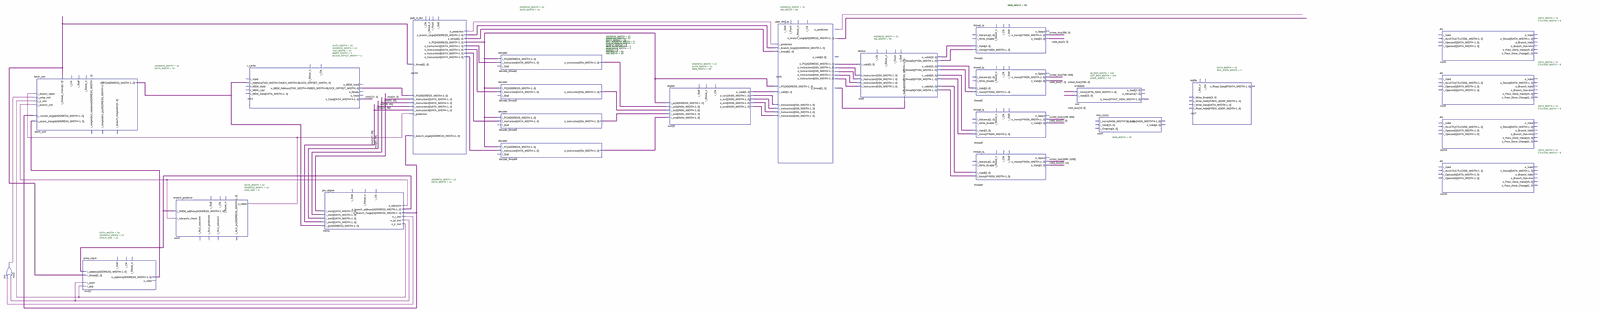
[diagram p0: schematic sheet, whole]
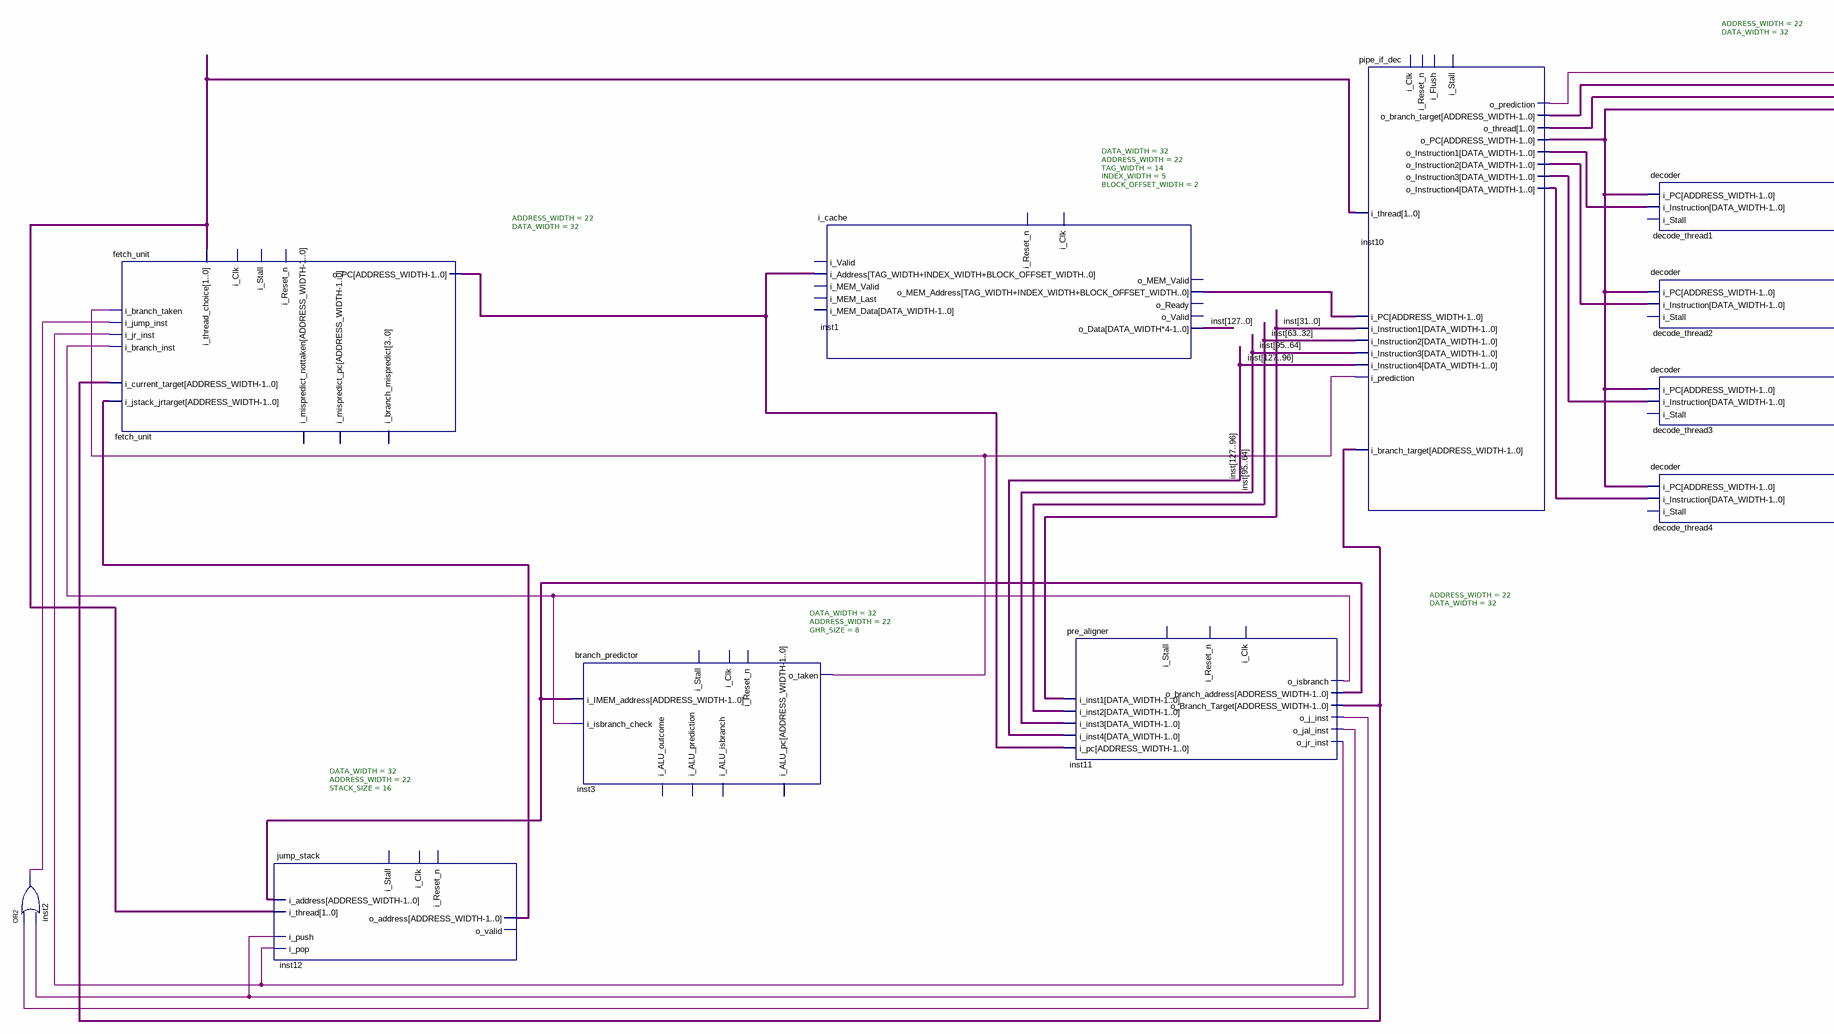
[diagram p1: schematic sheet, left part]
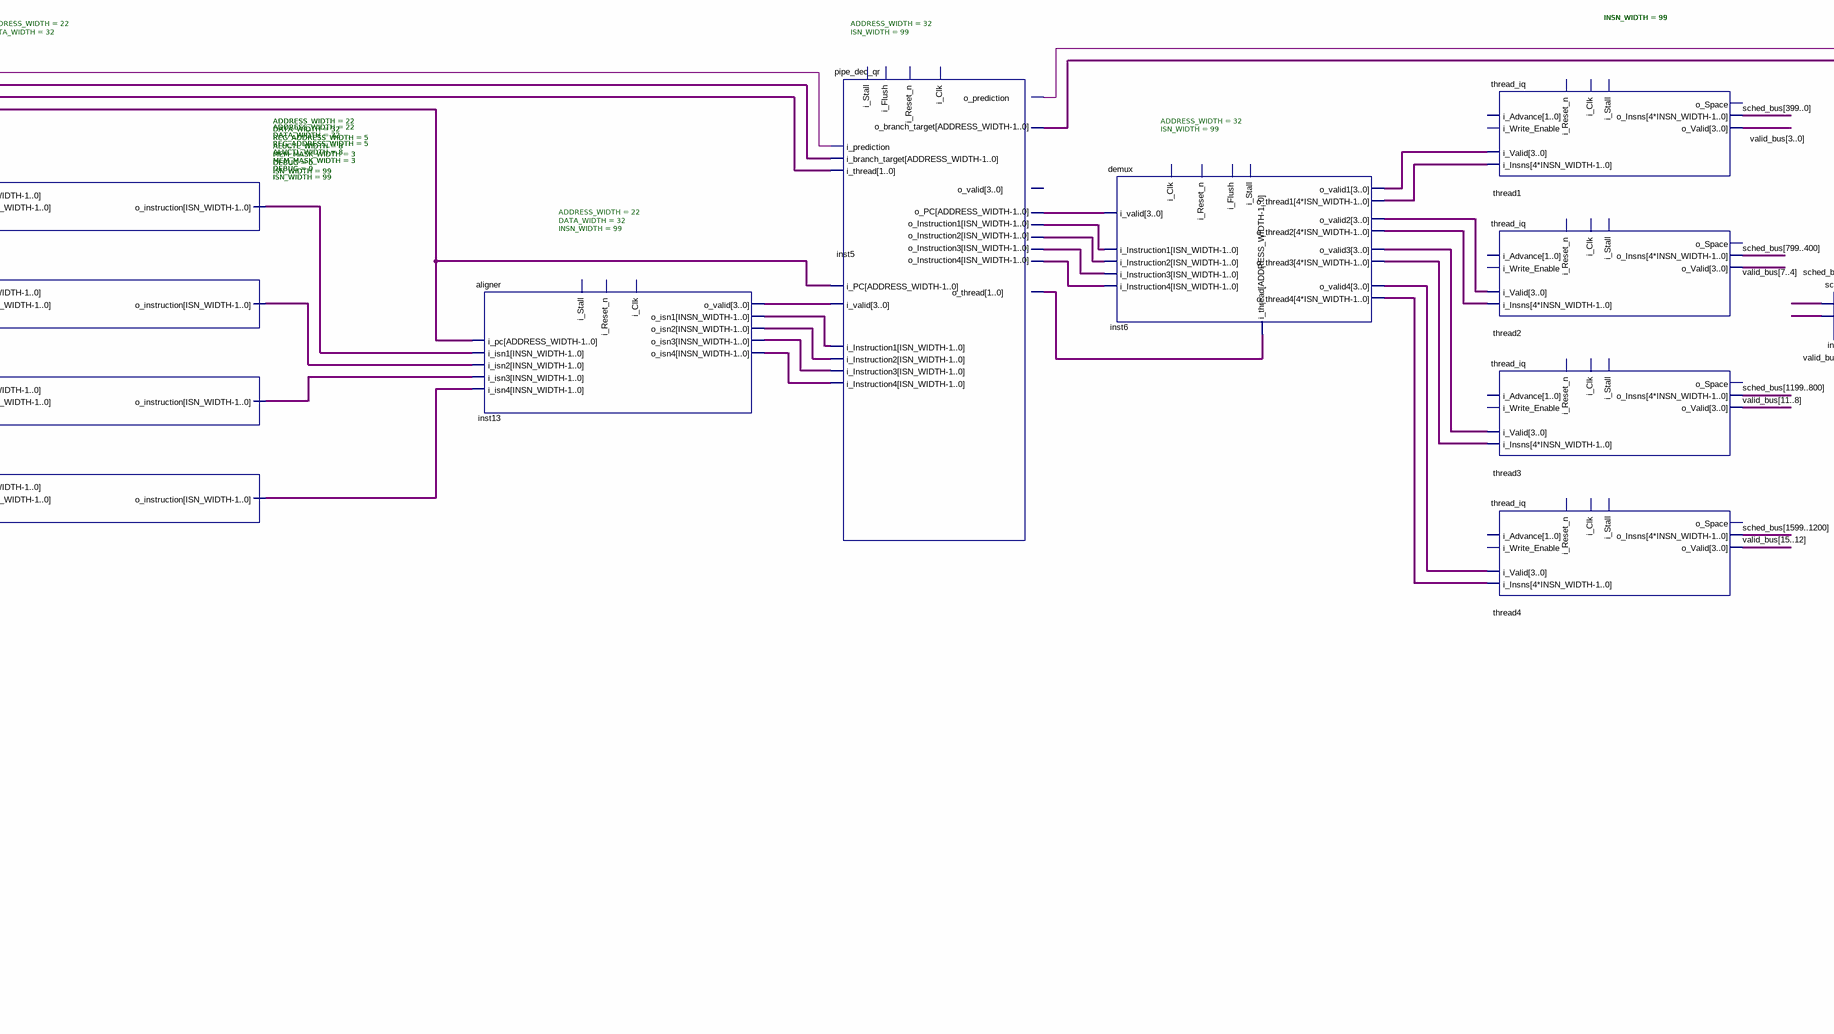
[diagram p2: schematic sheet, centre part]
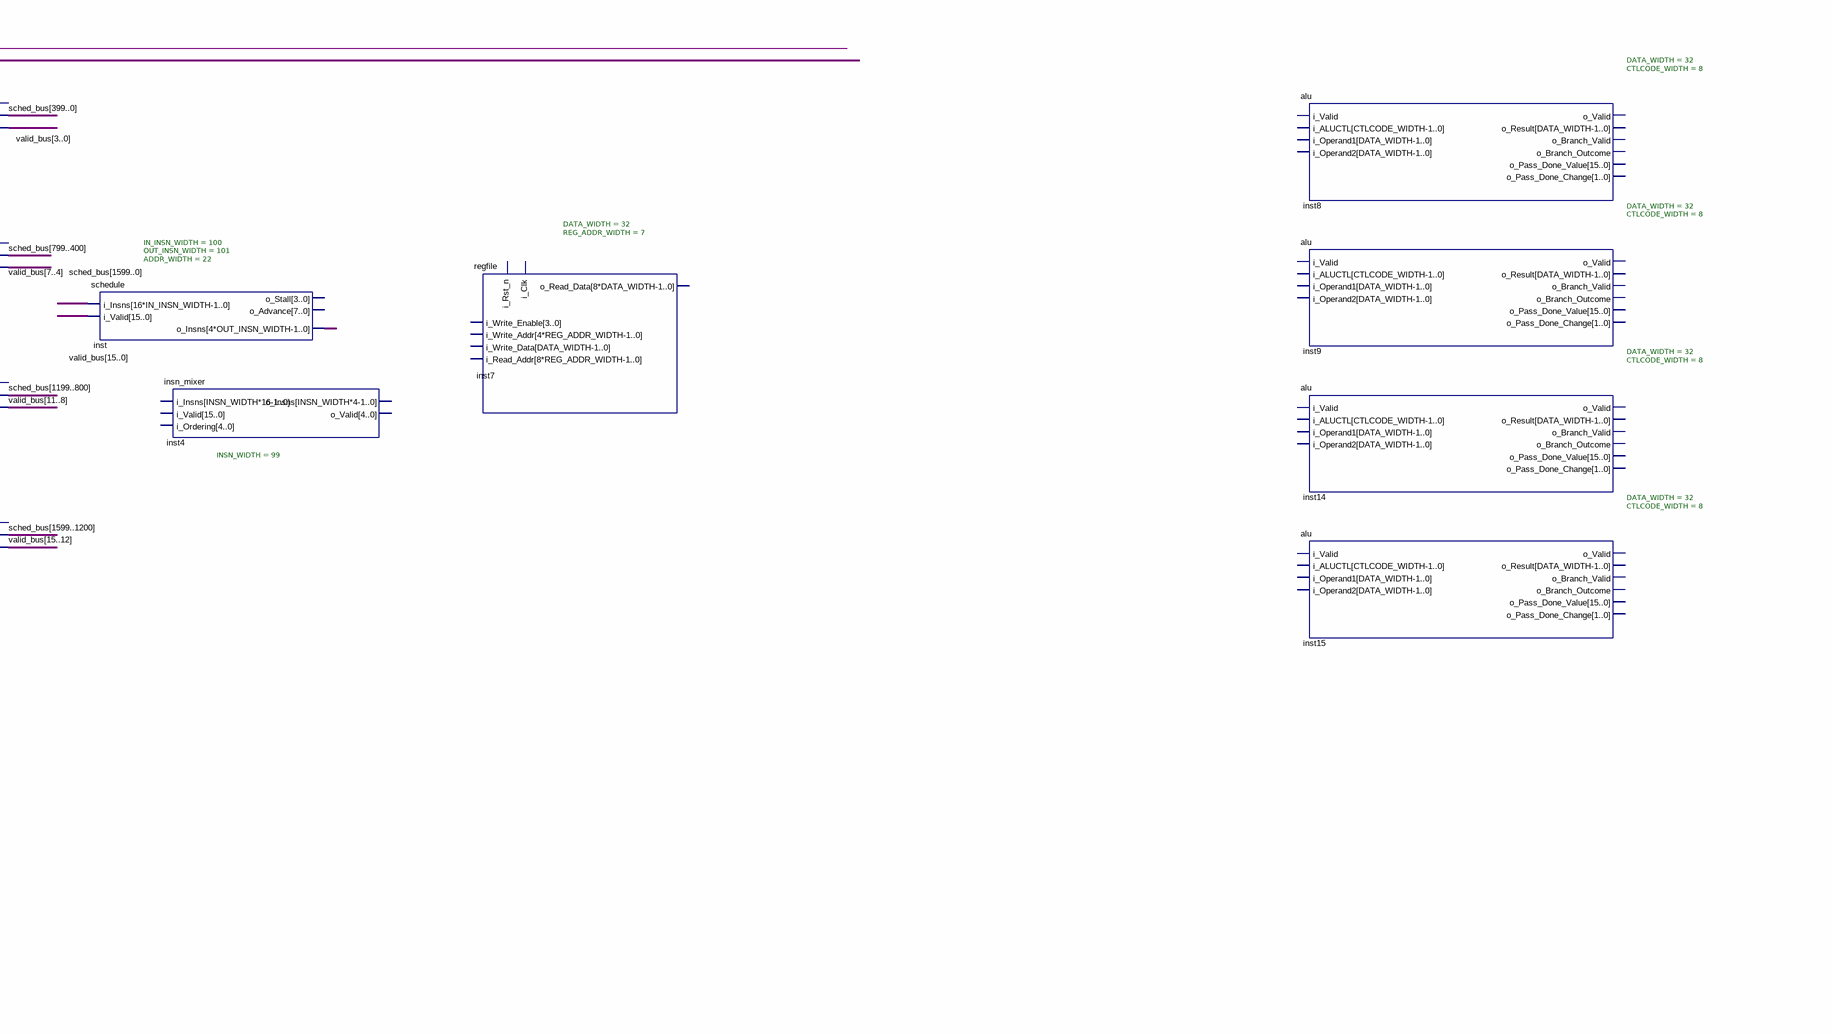
[diagram p3: schematic sheet, right part]
// Quartus schematic SMT-Proc.bdf as structural Verilog: 25 symbols, 0 pins
module \SMT-Proc  (
);

  wire inst2_out, inst3_o_taken, inst5_o_prediction, inst10_o_prediction, inst11_o_isbranch, inst11_o_j_inst,
       inst11_o_jal_inst, inst11_o_jr_inst;
  wire [1:0] inst10_o_thread, undriven;
  wire [3:0] inst6_o_valid1, inst6_o_valid2, inst6_o_valid3, inst6_o_valid4, inst13_o_valid;
  wire [15:0] valid_bus;
  wire [21:0] fetch_unit_o_pc, inst1_o_mem_address, inst11_o_branch_address, inst11_o_branch_target,
       inst12_o_address;
  wire [31:0] inst5_o_branch_target, inst5_o_pc, inst5_o_thread, inst10_o_branch_target,
       inst10_o_instruction1, inst10_o_instruction2, inst10_o_instruction3, inst10_o_instruction4,
       inst10_o_pc;
  wire [98:0] decode_thread1_o_instruction, decode_thread2_o_instruction, decode_thread3_o_instruction,
       decode_thread4_o_instruction, inst5_o_instruction1, inst5_o_instruction2, inst5_o_instruction3,
       inst5_o_instruction4, inst13_o_isn1, inst13_o_isn2, inst13_o_isn3, inst13_o_isn4;
  wire [127:0] inst;
  wire [395:0] inst6_o_thread1, inst6_o_thread2, inst6_o_thread3, inst6_o_thread4;
  wire [403:0] inst_o_insns;
  wire [1599:0] sched_bus;

  or inst2 (inst2_out, inst11_o_j_inst, inst11_o_jal_inst);
  fetch_unit #(.ADDRESS_WIDTH(22), .DATA_WIDTH(32)) fetch_unit (
    .i_branch_taken(inst3_o_taken), .i_jump_inst(inst2_out), .i_jr_inst(inst11_o_jr_inst),
    .i_branch_inst(inst11_o_isbranch), .i_thread_choice(undriven), .i_current_target(inst11_o_branch_target),
    .i_jstack_jrtarget(inst12_o_address), .o_PC(fetch_unit_o_pc));  // open: i_Clk, i_Reset_n, i_Stall, i_branch_mispredict, i_mispredict_nottaken, i_mispredict_pc
  jump_stack #(.DATA_WIDTH(32), .ADDRESS_WIDTH(22), .STACK_SIZE(16)) inst12 (
    .i_address(inst11_o_branch_address), .i_thread(undriven), .i_pop(inst11_o_jr_inst),
    .i_push(inst11_o_jal_inst), .o_address(inst12_o_address));  // open: i_Clk, i_Stall, i_Reset_n, o_valid
  branch_predictor #(.DATA_WIDTH(32), .ADDRESS_WIDTH(22), .GHR_SIZE(8)) inst3 (
    .i_IMEM_address(inst11_o_branch_address), .i_isbranch_check(inst11_o_isbranch), .o_taken(inst3_o_taken));  // open: i_Clk, i_ALU_outcome, i_ALU_pc, i_ALU_isbranch, i_ALU_prediction, i_Reset_n, i_Stall
  i_cache #(.DATA_WIDTH(32), .ADDRESS_WIDTH(22), .TAG_WIDTH(14), .INDEX_WIDTH(5), .BLOCK_OFFSET_WIDTH(2)) inst1 (
    .i_Address(fetch_unit_o_pc), .o_MEM_Address(inst1_o_mem_address), .o_Data(inst));  // open: i_Clk, i_Reset_n, i_Valid, i_MEM_Valid, i_MEM_Last, i_MEM_Data, o_MEM_Valid, o_Ready, o_Valid
  pre_aligner #(.ADDRESS_WIDTH(22), .DATA_WIDTH(32)) inst11 (
    .i_pc(fetch_unit_o_pc), .i_inst1(inst[31:0]), .i_inst2(inst[63:32]), .i_inst3(inst[95:64]),
    .i_inst4(inst[127:96]), .o_isbranch(inst11_o_isbranch), .o_branch_address(inst11_o_branch_address),
    .o_Branch_Target(inst11_o_branch_target), .o_j_inst(inst11_o_j_inst), .o_jal_inst(inst11_o_jal_inst),
    .o_jr_inst(inst11_o_jr_inst));  // open: i_Clk, i_Reset_n, i_Stall
  pipe_if_dec #(.ADDRESS_WIDTH(22), .DATA_WIDTH(32)) inst10 (
    .i_PC(inst1_o_mem_address), .i_Instruction1(inst[31:0]), .i_Instruction2(inst[63:32]),
    .i_Instruction3(inst[95:64]), .i_Instruction4(inst[127:96]), .i_prediction(inst3_o_taken),
    .i_branch_target(inst11_o_branch_target), .i_thread(undriven), .o_PC(inst10_o_pc),
    .o_Instruction1(inst10_o_instruction1), .o_Instruction2(inst10_o_instruction2),
    .o_Instruction3(inst10_o_instruction3), .o_Instruction4(inst10_o_instruction4),
    .o_prediction(inst10_o_prediction), .o_branch_target(inst10_o_branch_target), .o_thread(inst10_o_thread));  // open: i_Clk, i_Reset_n, i_Flush, i_Stall
  decoder #(.ADDRESS_WIDTH(22), .DATA_WIDTH(32), .REG_ADDRESS_WIDTH(5), .ALUCTL_WIDTH(8), .MEM_MASK_WIDTH(3), .DEBUG(0), .ISN_WIDTH(99)) decode_thread1 (
    .i_PC(inst10_o_pc), .i_Instruction(inst10_o_instruction1), .o_instruction(decode_thread1_o_instruction));  // open: i_Stall
  decoder #(.ADDRESS_WIDTH(22), .DATA_WIDTH(32), .REG_ADDRESS_WIDTH(5), .ALUCTL_WIDTH(8), .MEM_MASK_WIDTH(3), .DEBUG(0), .ISN_WIDTH(99)) decode_thread2 (
    .i_PC(inst10_o_pc), .i_Instruction(inst10_o_instruction2), .o_instruction(decode_thread2_o_instruction));  // open: i_Stall
  decoder #(.ADDRESS_WIDTH(22), .DATA_WIDTH(32), .REG_ADDRESS_WIDTH(5), .ALUCTL_WIDTH(8), .MEM_MASK_WIDTH(3), .DEBUG(0), .ISN_WIDTH(99)) decode_thread3 (
    .i_PC(inst10_o_pc), .i_Instruction(inst10_o_instruction3), .o_instruction(decode_thread3_o_instruction));  // open: i_Stall
  decoder #(.ADDRESS_WIDTH(22), .DATA_WIDTH(32), .REG_ADDRESS_WIDTH(5), .ALUCTL_WIDTH(8), .MEM_MASK_WIDTH(3), .DEBUG(0), .ISN_WIDTH(99)) decode_thread4 (
    .i_PC(inst10_o_pc), .i_Instruction(inst10_o_instruction4), .o_instruction(decode_thread4_o_instruction));  // open: i_Stall
  aligner #(.ADDRESS_WIDTH(22), .DATA_WIDTH(32), .INSN_WIDTH(99)) inst13 (
    .i_pc(inst10_o_pc), .i_isn1(decode_thread1_o_instruction), .i_isn2(decode_thread2_o_instruction),
    .i_isn3(decode_thread3_o_instruction), .i_isn4(decode_thread4_o_instruction), .o_valid(inst13_o_valid),
    .o_isn1(inst13_o_isn1), .o_isn2(inst13_o_isn2), .o_isn3(inst13_o_isn3), .o_isn4(inst13_o_isn4));  // open: i_Clk, i_Reset_n, i_Stall
  pipe_dec_qr #(.ADDRESS_WIDTH(32), .ISN_WIDTH(99)) inst5 (
    .i_PC(inst10_o_pc), .i_Instruction1(inst13_o_isn1), .i_Instruction2(inst13_o_isn2),
    .i_Instruction3(inst13_o_isn3), .i_Instruction4(inst13_o_isn4), .i_prediction(inst10_o_prediction),
    .i_branch_target(inst10_o_branch_target), .i_thread(inst10_o_thread), .i_valid(inst13_o_valid),
    .o_PC(inst5_o_pc), .o_Instruction1(inst5_o_instruction1), .o_Instruction2(inst5_o_instruction2),
    .o_Instruction3(inst5_o_instruction3), .o_Instruction4(inst5_o_instruction4),
    .o_prediction(inst5_o_prediction), .o_branch_target(inst5_o_branch_target), .o_thread(inst5_o_thread));  // open: i_Clk, i_Reset_n, i_Flush, i_Stall, o_valid
  demux #(.ADDRESS_WIDTH(32), .ISN_WIDTH(99)) inst6 (
    .i_thread(inst5_o_thread), .i_valid(inst5_o_pc), .i_Instruction1(inst5_o_instruction1),
    .i_Instruction2(inst5_o_instruction2), .i_Instruction3(inst5_o_instruction3),
    .i_Instruction4(inst5_o_instruction4), .o_thread1(inst6_o_thread1), .o_thread2(inst6_o_thread2),
    .o_thread3(inst6_o_thread3), .o_thread4(inst6_o_thread4), .o_valid1(inst6_o_valid1),
    .o_valid2(inst6_o_valid2), .o_valid3(inst6_o_valid3), .o_valid4(inst6_o_valid4));  // open: i_Clk, i_Reset_n, i_Flush, i_Stall
  thread_iq #(.INSN_WIDTH(99)) thread1 (
    .i_Insns(inst6_o_thread1), .i_Valid(inst6_o_valid1), .o_Insns(sched_bus[399:0]), .o_Valid(valid_bus[3:0]));  // open: i_Clk, i_Reset_n, i_Stall, i_Advance, i_Write_Enable, o_Space
  thread_iq #(.INSN_WIDTH(99)) thread2 (
    .i_Insns(inst6_o_thread2), .i_Valid(inst6_o_valid2), .o_Insns(sched_bus[799:400]),
    .o_Valid(valid_bus[7:4]));  // open: i_Clk, i_Reset_n, i_Stall, i_Advance, i_Write_Enable, o_Space
  thread_iq #(.INSN_WIDTH(99)) thread3 (
    .i_Insns(inst6_o_thread3), .i_Valid(inst6_o_valid3), .o_Insns(sched_bus[1199:800]),
    .o_Valid(valid_bus[11:8]));  // open: i_Clk, i_Reset_n, i_Stall, i_Advance, i_Write_Enable, o_Space
  thread_iq #(.INSN_WIDTH(99)) thread4 (
    .i_Insns(inst6_o_thread4), .i_Valid(inst6_o_valid4), .o_Insns(sched_bus[1599:1200]),
    .o_Valid(valid_bus[15:12]));  // open: i_Clk, i_Reset_n, i_Stall, i_Advance, i_Write_Enable, o_Space
  schedule #(.IN_INSN_WIDTH(100), .OUT_INSN_WIDTH(101), .ADDR_WIDTH(22)) u_inst (
    .i_Insns(sched_bus), .i_Valid(valid_bus), .o_Insns(inst_o_insns));  // open: o_Stall, o_Advance
  insn_mixer #(.INSN_WIDTH(99)) inst4 ();  // open: i_Insns, i_Valid, i_Ordering, o_Insns, o_Valid
  regfile #(.DATA_WIDTH(32), .REG_ADDR_WIDTH(7)) inst7 ();  // open: i_Clk, i_Rst_n, i_Read_Addr, i_Write_Enable, i_Write_Addr, i_Write_Data, o_Read_Data
  alu #(.DATA_WIDTH(32), .CTLCODE_WIDTH(8)) inst8 ();  // open: i_Valid, i_ALUCTL, i_Operand1, i_Operand2, o_Valid, o_Result, o_Branch_Valid, o_Branch_Outcome, o_Pass_Done_Value, o_Pass_Done_Change
  alu #(.DATA_WIDTH(32), .CTLCODE_WIDTH(8)) inst9 ();  // open: i_Valid, i_ALUCTL, i_Operand1, i_Operand2, o_Valid, o_Result, o_Branch_Valid, o_Branch_Outcome, o_Pass_Done_Value, o_Pass_Done_Change
  alu #(.DATA_WIDTH(32), .CTLCODE_WIDTH(8)) inst14 ();  // open: i_Valid, i_ALUCTL, i_Operand1, i_Operand2, o_Valid, o_Result, o_Branch_Valid, o_Branch_Outcome, o_Pass_Done_Value, o_Pass_Done_Change
  alu #(.DATA_WIDTH(32), .CTLCODE_WIDTH(8)) inst15 ();  // open: i_Valid, i_ALUCTL, i_Operand1, i_Operand2, o_Valid, o_Result, o_Branch_Valid, o_Branch_Outcome, o_Pass_Done_Value, o_Pass_Done_Change
endmodule
